# Altium schematic sheet Display Module.SchDoc: Display
size A4; SheetNumber: 2; SheetTotal: 3
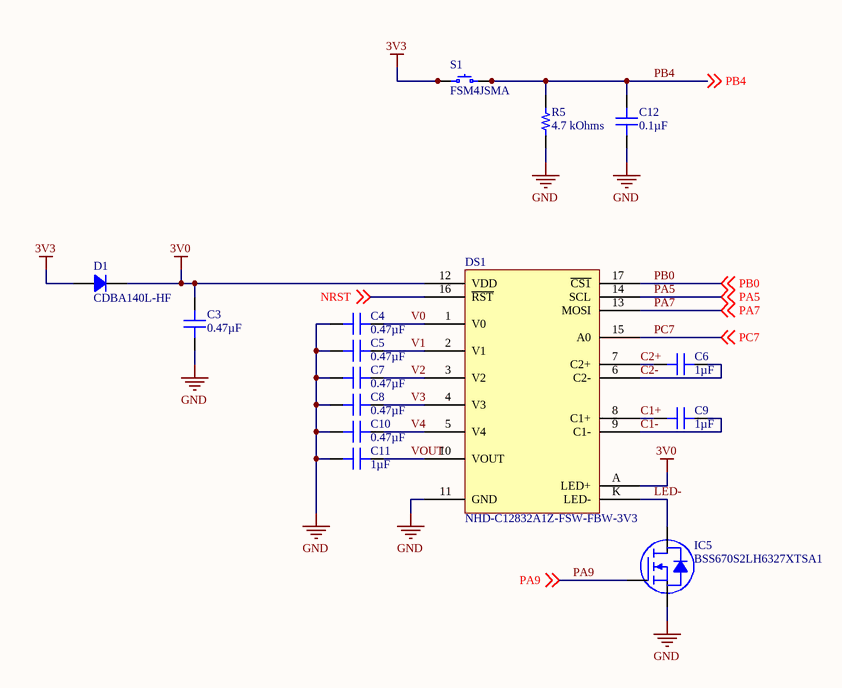
[diagram p0: Display Module.SchDoc]

## Parts
C3  0.47µF  [CAP 0603_1608]
C4  0.47µF  [CAP 0603_1608]
C5  0.47µF  [CAP 0603_1608]
C6  1µF  [CAP 0603_1608]
C7  0.47µF  [CAP 0603_1608]
C8  0.47µF  [CAP 0603_1608]
C9  1µF  [CAP 0603_1608]
C10  0.47µF  [CAP 0603_1608]
C11  1µF  [CAP 0603_1608]
C12  0.1µF  [CAP 0603_1608]
D1  CDBA140L-HF  [DO214AC SMA]
DS1  NHD-C12832A1Z-FSW-FBW-3V3  [NHD-C12832A1Z WHITE]
IC5  BSS670S2LH6327XTSA1  [INFINEON SOT-23-3]
R5  4.7 kOhms  [RES 0603_1608]
S1  FSM4JSMA  [TE FSM4JSMA]

## Nets
3V0: C3.1 D1.2 DS1.12(VDD) DS1.A(LED+)
3V3: D1.1 S1.1 S1.2
GND: C3.2 C4.2 C5.2 C7.2 C8.2 C10.2 C11.1 C12.1 DS1.11(GND) IC5.2(S) R5.1
C1+: C9.1 DS1.8(C1+)
C1-: C9.2 DS1.9(C1-)
C2+: C6.1 DS1.7(C2+)
C2-: C6.2 DS1.6(C2-)
LED-: DS1.K(LED-) IC5.3(D)
NRST: DS1.16(~{RST}) ; off-sheet NRST
PA5: DS1.14(SCL) ; off-sheet PA5
PA7: DS1.13(MOSI) ; off-sheet PA7
PA9: IC5.1(G) ; off-sheet PA9
PB0: DS1.17(~{CS1}) ; off-sheet PB0
PB4: C12.2 R5.2 S1.3 S1.4 ; off-sheet PB4
PC7: DS1.15(A0) ; off-sheet PC7
V0: C4.1 DS1.1(V0)
V1: C5.1 DS1.2(V1)
V2: C7.1 DS1.3(V2)
V3: C8.1 DS1.4(V3)
V4: C10.1 DS1.5(V4)
VOUT: C11.2 DS1.10(VOUT)

## Notes on the sheet
- Title
- Size:
- Date:
- A4
- Number:
- Time:
- Revision:
- Sheet
- of
- File:

## Library data of the parts
C3-C5 C7 C8 C10 = 0603B474K100CT: CAP CER 0.47UF 10V X7R 0603; Manufacturer: Walsin Technology Corporation; Tolerance: ±10%; Part Number: 0603B474K100CT; Value: 0.47µF; Applications: General Purpose; Capacitance: 0.47µF; ComponentLink1Description: Datasheet; ComponentLink1URL: http://www.passivecomponent.com/wp-content/uploads/2018/10/MLCC.pdf; ComponentLink2Description: DigiKey Link; ComponentLink2URL: http://digikey.com/product-detail/en/walsin-technology-corporation/0603B474K100CT/1292-1450-1-ND/9355454; Device Package: 0603 (1608 Metric); LastUpdated: 02/09/2020 01:03:16; Lifecycle Status: Active; Minimum Order: 1; Mounting Type: Surface Mount, MLCC; Operating Temperature: -55°C ~ 125°C; Package / Case: 0603 (1608 Metric); Packaging: TapeAndReel; PartId: 13392; Part Status: Active; Price: 0.01; Series: -; Size / Dimension: 0.063" L x 0.031" W (1.60mm x 0.80mm); Supplier 1: DigiKey; Supplier Part Number 1: 1292-1450-1-ND; Temperature Coefficient: X7R; Thickness (Max): 0.037" (0.95mm); Voltage - Rated: 10V
C6 C9 C11 = LMK107B7105KA-T: CAP CER 1UF 10V X7R 0603; Manufacturer: Taiyo Yuden; Tolerance: ±10%; Part Number: LMK107B7105KA-T; Value: 1µF; Applications: General Purpose; Capacitance: 1µF; ComponentLink1Description: Datasheet; ComponentLink1URL: https://www.yuden.co.jp/productdata/catalog/mlcc01_e.pdf; ComponentLink2Description: DigiKey Link; ComponentLink2URL: http://digikey.com/product-detail/en/taiyo-yuden/LMK107B7105KA-T/587-1242-1-ND/931019; Device Package: 0603 (1608 Metric); LastUpdated: 02/09/2020 01:03:30; Lifecycle Status: Active; Minimum Order: 1; Mounting Type: Surface Mount, MLCC; Operating Temperature: -55°C ~ 125°C; Package / Case: 0603 (1608 Metric); Packaging: TapeAndReel; PartId: 5525; Part Status: Active; Price: 0.01; Series: M; Size / Dimension: 0.063" L x 0.031" W (1.60mm x 0.80mm); Supplier 1: DigiKey; Supplier Part Number 1: 587-1242-1-ND; Temperature Coefficient: X7R; Thickness (Max): 0.035" (0.90mm); Voltage - Rated: 10V
C12 = 06035C104JAT4A: CAP CER 0.1UF 50V X7R 0603; Manufacturer: AVX Corporation; Tolerance: ±5%; Part Number: 06035C104JAT4A; Value: 0.1µF; Applications: General Purpose; Capacitance: 0.1µF; ComponentLink1Description: Datasheet; ComponentLink1URL: http://datasheets.avx.com/X7RDielectric.pdf; ComponentLink2Description: DigiKey Link; ComponentLink2URL: http://digikey.com/product-detail/en/avx-corporation/06035C104JAT4A/478-12459-1-ND/9749311; Device Package: 0603 (1608 Metric); LastUpdated: 02/09/2020 01:03:34; Lifecycle Status: Active; Minimum Order: 1; Mounting Type: Surface Mount, MLCC; Operating Temperature: -55°C ~ 125°C; Package / Case: 0603 (1608 Metric); Packaging: TapeAndReel; PartId: 3002; Part Status: Active; Price: 0.01; Series: -; Size / Dimension: 0.063" L x 0.032" W (1.60mm x 0.81mm); Supplier 1: DigiKey; Supplier Part Number 1: 478-12459-1-ND; Temperature Coefficient: X7R; Thickness (Max): 0.035" (0.90mm); Voltage - Rated: 50V
D1 = CDBA140L-HF: DIODE SCHOTTKY 40V 1A DO214AC; Manufacturer: Comchip Technology; Capacitance @ Vr, F: 130pF @ 4V, 1MHz; Current - Reverse Leakage @ Vr: 1mA @ 40V; Speed: Fast Recovery =< 500ns, > 200mA (Io); Voltage - Forward (Vf) (Max) @ If: 400mV @ 1A; Part Number: CDBA140L-HF; ComponentLink1Description: Datasheet; ComponentLink1URL: http://www.comchiptech.com/admin/files/product/CDBA140L-HF RevC513944.pdf; ComponentLink2Description: DigiKey Link; ComponentLink2URL: http://digikey.com/product-detail/en/comchip-technology/CDBA140L-HF/641-1691-1-ND/5226074; Current - Average Rectified (Io): 1A; Diode Type: Schottky; LastUpdated: 02/09/2020 01:19:02; Lifecycle Status: Active; Minimum Order: 1; Mounting Type: Surface Mount; Operating Temperature - Junction: -50°C ~ 100°C; Package / Case: DO-214AC, SMA; Packaging: TapeAndReel; PartId: 2148; Part Status: Active; Price: 0.10; Series: -; Supplier 1: DigiKey; Supplier Part Number 1: 641-1691-1-ND; Supplier Device Package: DO-214AC (SMA); Voltage - DC Reverse (Vr) (Max): 40V
DS1 = NHD-C12832A1Z-FSW-FBW-3V3: LCD COG GRAPHIC 128X32; Manufacturer: Newhaven Display Intl; Background Color: White (Black - Inverted); Backlight: LED - White; Display Mode: Transflective; Display Type: FSTN - Film Super-Twisted Nematic; Interface: SPI; Viewing Area: 36.00mm W x 12.00mm H; Part Number: NHD-C12832A1Z-FSW-FBW-3V3; ComponentLink1Description: Datasheet; ComponentLink1URL: http://www.newhavendisplay.com/specs/NHD-C12832A1Z-FSW-FBW-3V3.pdf; ComponentLink2Description: DigiKey Link; ComponentLink2URL: //digikey.com/product-detail/en/newhaven-display-intl/NHD-C12832A1Z-FSW-FBW-3V3/NHD-C12832A1Z-FSW-FBW-3V3-ND/2059236; LastUpdated: 04/12/2019 12:49:03; Lifecycle Status: 0; Minimum Order: 1; Packaging: Unknown; PartId: 1; Part Status: Active; Price: 11.53; Series: -; Supplier 1: DigiKey; Supplier Part Number 1: NHD-C12832A1Z-FSW-FBW-3V3-ND
IC5 = BSS670S2LH6327XTSA1: MOSFET N-CH 55V 540MA SOT23; Manufacturer: Infineon Technologies; Current - Continuous Drain (Id) @ 25°C: 540mA (Ta); Drive Voltage (Max Rds On,  Min Rds On): 4.5V, 10V; FET Type: N-Channel; Gate Charge (Qg) (Max) @ Vgs: 2.26nC @ 10V; Input Capacitance (Ciss) (Max) @ Vds: 75pF @ 25V; Power Dissipation (Max): 360mW (Ta); Rds On (Max) @ Id, Vgs: 650mOhm @ 270mA, 10V; Vgs (Max): ±20V; Vgs(th) (Max) @ Id: 2V @ 2.7µA; Part Number: BSS670S2LH6327XTSA1; ComponentLink1Description: Datasheet; ComponentLink1URL: https://www.infineon.com/dgdl/BSS670S2L_Rev2.5.pdf?folderId=db3a3043156fd573011622e10b5c1f67&fileId=db3a304330f68606013109e4a7fb0094; ComponentLink2Description: DigiKey Link; ComponentLink2URL: http://digikey.com/product-detail/en/infineon-technologies/BSS670S2LH6327XTSA1/BSS670S2LH6327XTSA1CT-ND/3196653; Drain to Source Voltage (Vdss): 55V; LastUpdated: 02/09/2020 01:25:05; Lifecycle Status: Active; Minimum Order: 1; Mounting Type: Surface Mount; Operating Temperature: -55°C ~ 150°C (TJ); Package / Case: TO-236-3, SC-59, SOT-23-3; Packaging: TapeAndReel; Part Status: Active; Price: 0.07; Series: OptiMOS™; Supplier 1: DigiKey; Supplier Part Number 1: BSS670S2LH6327XTSA1CT-ND; Supplier Device Package: SOT-23-3; Technology: MOSFET (Metal Oxide)
R5 = ERJ-3EKF4701V: RES SMD 4.7K OHM 1% 1/10W 0603; Manufacturer: Panasonic Electronic Components; Power (Watts): 0.1W, 1/10W; Temperature Coefficient: ±100ppm/°C; Part Number: ERJ-3EKF4701V; Value: 4.7 kOhms; ComponentLink1Description: Datasheet; ComponentLink1URL: https://industrial.panasonic.com/cdbs/www-data/pdf/RDA0000/AOA0000C304.pdf; ComponentLink2Description: DigiKey Link; ComponentLink2URL: http://digikey.com/product-detail/en/panasonic-electronic-components/ERJ-3EKF4701V/P4.70KHCT-ND/1746782; Composition: Thick Film; Device Package: 0603 (1608 Metric); Features: Automotive AEC-Q200; Height - Seated (Max): 0.022" (0.55mm); LastUpdated: 02/09/2020 01:10:23; Lifecycle Status: Active; Minimum Order: 1; Number of Terminations: 2; Operating Temperature: -55°C ~ 155°C; Package / Case: 0603 (1608 Metric); Packaging: TapeAndReel; PartId: 5645; Part Status: Active; Price: 0.01; Ratings: AEC-Q200; Resistance: 4.7 kOhms; Series: ERJ; Size / Dimension: 0.063" L x 0.031" W (1.60mm x 0.80mm); Supplier 1: DigiKey; Supplier Part Number 1: P4.70KHCT-ND; Supplier Device Package: 0603; Tolerance: ±1%
S1 = FSM4JSMA: SWITCH TACTILE SPST-NO 0.05A 24V; Manufacturer: TE Connectivity ALCOSWITCH Switches; Actuator Height off PCB, Vertical: 5.00mm; Actuator Orientation: Top Actuated; Actuator Type: Standard; Contact Rating @ Voltage: 0.05A @ 24VDC; Illumination: Non-Illuminated; Operating Force: 160gf; Outline: 6.00mm x 6.00mm; Switch Function: Off-Mom; Part Number: FSM4JSMA; Circuit: SPST-NO; ComponentLink1Description: Datasheet; ComponentLink1URL: https://www.te.com/commerce/DocumentDelivery/DDEController?Action=srchrtrv&DocNm=1308111-1_SWITCHES_CORE_PROGRAM_CATALOG&DocType=CS&DocLang=English; ComponentLink2Description: DigiKey Link; ComponentLink2URL: http://digikey.com/product-detail/en/te-connectivity-alcoswitch-switches/FSM4JSMA/450-1129-ND/525821; LastUpdated: 02/09/2020 01:27:07; Lifecycle Status: Active; Minimum Order: 1; Mounting Type: Surface Mount; Operating Temperature: -35°C ~ 85°C; Packaging: Bulk; Part Status: Active; Price: 0.23; Series: FSMJSMA; Supplier 1: DigiKey; Supplier Part Number 1: 450-1129-ND; Termination Style: Gull Wing